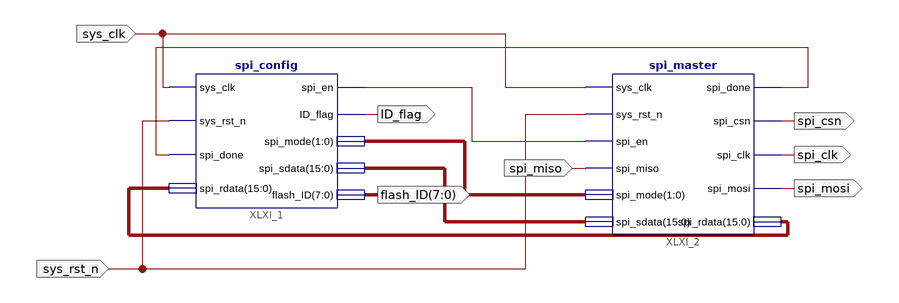
[diagram p0: schematic sheet 1]
// Xilinx ISE schematic spi_top.sch (spartan6) as structural Verilog: 2 symbols, 8 ports
module spi_top (
  input  sys_clk,
  input  sys_rst_n,
  input  spi_miso,
  output spi_csn,
  output spi_clk,
  output spi_mosi,
  output [7:0] flash_ID,
  output ID_flag
);

  wire XLXN_1, XLXN_6;
  wire [1:0] XLXN_3;
  wire [15:0] XLXN_2, XLXN_10;

  spi_config XLXI_1 (
    .sys_clk(sys_clk), .sys_rst_n(sys_rst_n), .spi_done(XLXN_6), .spi_rdata(XLXN_10), .spi_en(XLXN_1),
    .ID_flag(ID_flag), .spi_mode(XLXN_3), .spi_sdata(XLXN_2), .flash_ID(flash_ID));
  spi_master XLXI_2 (
    .sys_clk(sys_clk), .sys_rst_n(sys_rst_n), .spi_en(XLXN_1), .spi_miso(spi_miso), .spi_mode(XLXN_3),
    .spi_sdata(XLXN_2), .spi_done(XLXN_6), .spi_csn(spi_csn), .spi_clk(spi_clk), .spi_mosi(spi_mosi),
    .spi_rdata(XLXN_10));
endmodule
